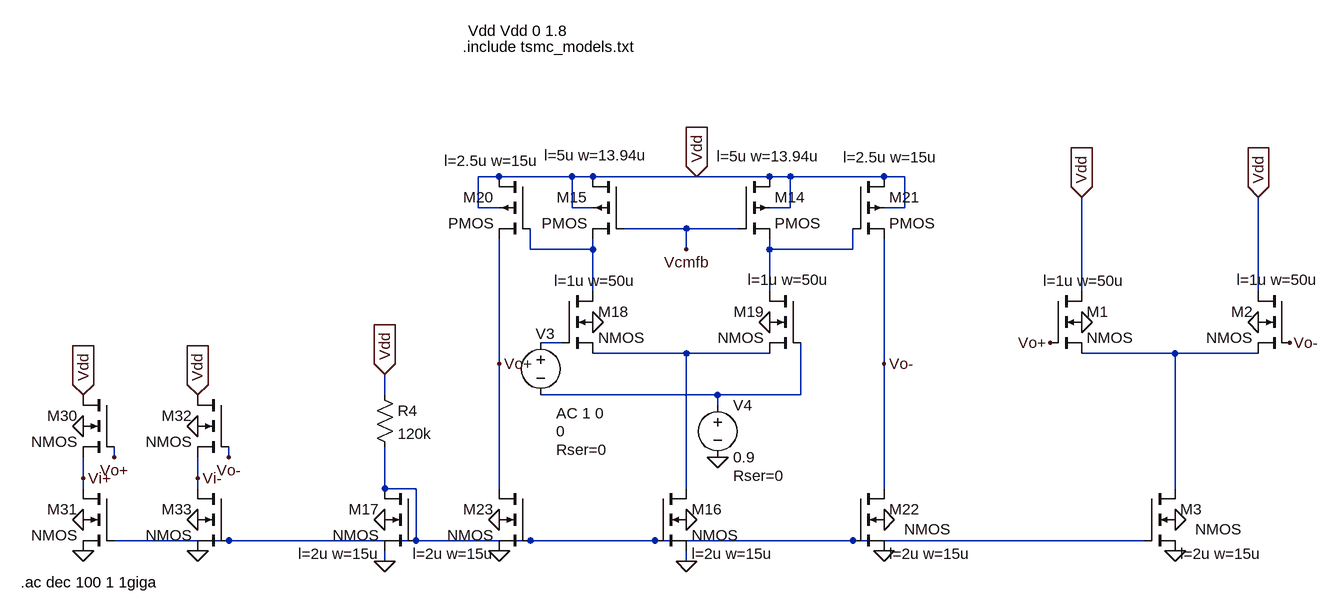
[diagram p0: schematic Draft7.asc]
Draft7.asc, the LTspice schematic file:
Version 4
SHEET 1 4508 724
WIRE 3152 -272 3120 -272
WIRE 3264 -272 3152 -272
WIRE 3296 -272 3264 -272
WIRE 3456 -272 3296 -272
WIRE 3568 -272 3456 -272
WIRE 3600 -272 3568 -272
WIRE 3744 -272 3600 -272
WIRE 3776 -272 3744 -272
WIRE 3120 -224 3120 -272
WIRE 3152 -224 3120 -224
WIRE 3264 -224 3264 -272
WIRE 3296 -224 3264 -224
WIRE 3600 -224 3600 -272
WIRE 3600 -224 3568 -224
WIRE 3776 -224 3776 -272
WIRE 3776 -224 3744 -224
WIRE 3440 -192 3344 -192
WIRE 3520 -192 3440 -192
WIRE 3200 -160 3200 -192
WIRE 3296 -160 3296 -176
WIRE 3296 -160 3200 -160
WIRE 3440 -160 3440 -192
WIRE 3568 -160 3568 -176
WIRE 3696 -160 3696 -192
WIRE 3696 -160 3568 -160
WIRE 3296 -96 3296 -160
WIRE 3568 -96 3568 -160
WIRE 4048 -96 4048 -240
WIRE 4320 -96 4320 -240
WIRE 3248 -16 3216 -16
WIRE 3440 0 3296 0
WIRE 3568 0 3440 0
WIRE 4192 0 4048 0
WIRE 4320 0 4192 0
WIRE 3152 16 3152 -176
WIRE 3744 16 3744 -176
WIRE 2976 64 2976 32
WIRE 3488 64 3216 64
WIRE 3616 64 3616 -16
WIRE 3616 64 3488 64
WIRE 3488 80 3488 64
WIRE 2560 160 2560 144
WIRE 2736 160 2736 144
WIRE 2512 192 2512 160
WIRE 2688 192 2688 160
WIRE 2512 208 2512 192
WIRE 2688 208 2688 192
WIRE 2976 208 2976 144
WIRE 3024 208 2976 208
WIRE 3152 208 3152 16
WIRE 3440 208 3440 0
WIRE 3744 208 3744 16
WIRE 4192 208 4192 0
WIRE 2736 288 2560 288
WIRE 3024 288 3024 208
WIRE 3024 288 2736 288
WIRE 3200 288 3024 288
WIRE 3392 288 3200 288
WIRE 3696 288 3392 288
WIRE 4144 288 3696 288
WIRE 2976 320 2976 304
WIRE 3440 320 3440 304
FLAG 2976 320 0
FLAG 3440 320 0
FLAG 3440 256 0
FLAG 2976 256 0
FLAG 3488 160 0
FLAG 3296 -48 0
FLAG 3568 -48 0
FLAG 3456 -272 Vdd
IOPIN 3456 -272 In
FLAG 2976 32 Vdd
IOPIN 2976 32 In
FLAG 3744 256 0
FLAG 3744 304 0
FLAG 3152 256 0
FLAG 3152 304 0
FLAG 3440 -160 Vcmfb
FLAG 3152 16 Vo+
FLAG 3744 16 Vo-
FLAG 2512 112 0
FLAG 2512 256 0
FLAG 2512 304 0
FLAG 2512 64 Vdd
IOPIN 2512 64 In
FLAG 2688 112 0
FLAG 2688 256 0
FLAG 2688 304 0
FLAG 2688 64 Vdd
IOPIN 2688 64 In
FLAG 2560 160 Vo+
FLAG 2736 160 Vo-
FLAG 2512 192 Vi+
FLAG 2688 192 Vi-
FLAG 4048 -48 0
FLAG 4320 -48 0
FLAG 4000 -16 Vo+
FLAG 4368 -16 Vo-
FLAG 4048 -240 Vdd
IOPIN 4048 -240 In
FLAG 4320 -240 Vdd
IOPIN 4320 -240 In
FLAG 4192 256 0
FLAG 4192 304 0
DATAFLAG 3744 -112 ""
DATAFLAG 3152 -96 ""
DATAFLAG 3632 -160 ""
DATAFLAG 3440 -192 ""
SYMBOL pmos4 3520 -272 R0
WINDOW 123 -33 -31 Left 2
SYMATTR Value2 l=5u w=13.94u
SYMATTR InstName M14
SYMBOL pmos4 3344 -272 M0
WINDOW 123 -36 -33 Left 2
SYMATTR Value2 l=5u w=13.94u
SYMATTR InstName M15
SYMBOL nmos4 3392 208 R0
WINDOW 123 56 100 Left 2
SYMATTR Value2 l=2u w=15u
SYMATTR InstName M16
SYMBOL nmos4 3024 208 M0
WINDOW 123 56 100 Left 2
SYMATTR Value2 l=2u w=15u
SYMATTR InstName M17
SYMBOL nmos4 3248 -96 R0
WINDOW 123 -11 -16 Left 2
SYMATTR Value2 l=1u w=50u
SYMATTR InstName M18
SYMBOL nmos4 3616 -96 M0
WINDOW 123 -44 -17 Left 2
SYMATTR Value2 l=1u w=50u
SYMATTR InstName M19
SYMBOL res 2960 48 R0
SYMATTR InstName R4
SYMATTR Value 120k
SYMBOL voltage 3216 -32 R0
WINDOW 0 -8 2 Left 2
WINDOW 123 24 124 Left 2
WINDOW 39 24 180 Left 2
WINDOW 3 24 152 Left 2
SYMATTR InstName V3
SYMATTR Value2 AC 1 0
SYMATTR SpiceLine Rser=0
SYMATTR Value 0
SYMBOL voltage 3488 64 R0
WINDOW 123 0 0 Left 2
WINDOW 39 24 124 Left 2
SYMATTR SpiceLine Rser=0
SYMATTR InstName V4
SYMATTR Value 0.9
SYMBOL pmos4 3200 -272 M0
WINDOW 123 -13 -24 Left 2
SYMATTR Value2 l=2.5u w=15u
SYMATTR InstName M20
SYMBOL pmos4 3696 -272 R0
WINDOW 123 -15 -30 Left 2
SYMATTR Value2 l=2.5u w=15u
SYMATTR InstName M21
SYMBOL nmos4 3696 208 R0
WINDOW 123 56 100 Left 2
WINDOW 3 79 63 Left 2
SYMATTR Value2 l=2u w=15u
SYMATTR InstName M22
SYMBOL nmos4 3200 208 M0
WINDOW 123 56 100 Left 2
SYMATTR Value2 l=2u w=15u
SYMATTR InstName M23
SYMBOL nmos4 2560 64 M0
SYMATTR InstName M30
SYMBOL nmos4 2560 208 M0
SYMATTR InstName M31
SYMATTR Value2 l=2u w=50u
SYMBOL nmos4 2736 64 M0
SYMATTR InstName M32
SYMBOL nmos4 2736 208 M0
SYMATTR InstName M33
SYMATTR Value2 l=2u w=50u
SYMBOL nmos4 4000 -96 R0
WINDOW 123 -11 -16 Left 2
SYMATTR Value2 l=1u w=50u
SYMATTR InstName M1
SYMBOL nmos4 4368 -96 M0
WINDOW 123 -44 -17 Left 2
SYMATTR Value2 l=1u w=50u
SYMATTR InstName M2
SYMBOL nmos4 4144 208 R0
WINDOW 123 56 100 Left 2
WINDOW 3 79 63 Left 2
SYMATTR Value2 l=2u w=15u
SYMATTR InstName M3
TEXT 3096 -472 Left 2 !.include tsmc_models.txt
TEXT 3104 -496 Left 2 !Vdd Vdd 0 1.8
TEXT 2416 352 Left 2 !.ac dec 100 1 1giga

The netlist it stands for:
* Draft7.asc
M14 Vdd Vcmfb N002 Vdd PMOS l=5u w=13.94u
M15 Vdd Vcmfb N001 Vdd PMOS l=5u w=13.94u
M16 N004 N007 0 0 NMOS l=2u w=15u
M17 N007 N007 0 0 NMOS l=2u w=15u
M18 N001 N003 N004 0 NMOS l=1u w=50u
M19 N002 N006 N004 0 NMOS l=1u w=50u
R4 Vdd N007 120k
V3 N003 N006 0 AC 1 0 Rser=0
V4 N006 0 0.9 Rser=0
M20 Vdd N001 Vo+ Vdd PMOS l=2.5u w=15u
M21 Vdd N002 Vo- Vdd PMOS l=2.5u w=15u
M22 Vo- N007 0 0 NMOS l=2u w=15u
M23 Vo+ N007 0 0 NMOS l=2u w=15u
M30 Vdd Vo+ Vi+ 0 NMOS
M31 Vi+ N007 0 0 NMOS l=2u w=50u
M32 Vdd Vo- Vi- 0 NMOS
M33 Vi- N007 0 0 NMOS l=2u w=50u
M1 Vdd Vo+ N005 0 NMOS l=1u w=50u
M2 Vdd Vo- N005 0 NMOS l=1u w=50u
M3 N005 N007 0 0 NMOS l=2u w=15u
.model NMOS NMOS
.model PMOS PMOS
.lib standard.mos
.include tsmc_models.txt
Vdd Vdd 0 1.8
.ac dec 100 1 1giga
.backanno
.end